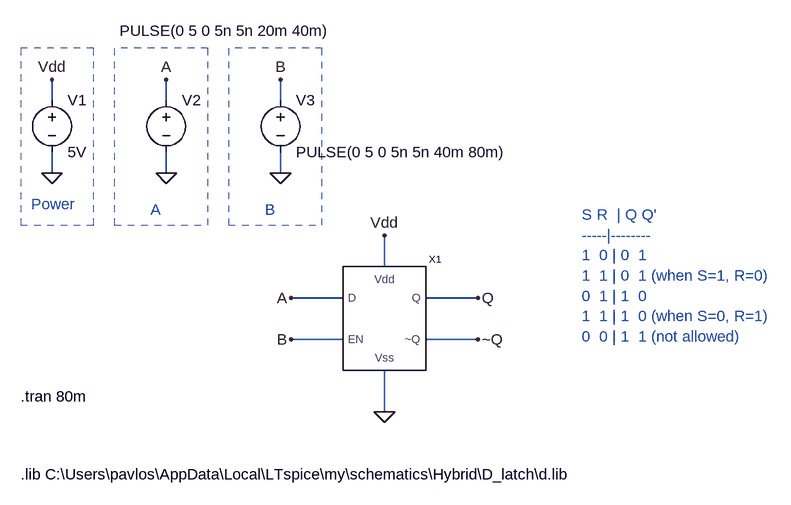
[diagram p0: schematic d_block.asc]
d_block.asc, the LTspice schematic file:
Version 4
SHEET 1 880 680
WIRE -560 -416 -560 -448
WIRE -384 -416 -384 -448
WIRE -208 -416 -208 -448
WIRE -560 -304 -560 -336
WIRE -384 -304 -384 -336
WIRE -208 -304 -208 -336
WIRE -48 -160 -48 -208
WIRE -112 -112 -192 -112
WIRE 96 -112 16 -112
WIRE -112 -48 -192 -48
WIRE 96 -48 16 -48
WIRE -48 64 -48 0
FLAG 96 -112 Q
FLAG -192 -112 A
FLAG -48 -208 Vdd
FLAG -48 64 0
FLAG -560 -304 0
FLAG -560 -448 Vdd
FLAG -384 -304 0
FLAG -384 -448 A
FLAG -192 -48 B
FLAG -208 -304 0
FLAG -208 -448 B
FLAG 96 -48 ~Q
SYMBOL voltage -560 -432 R0
WINDOW 123 0 0 Left 0
WINDOW 39 0 0 Left 0
SYMATTR InstName V1
SYMATTR Value 5V
SYMBOL voltage -384 -432 R0
WINDOW 123 0 0 Left 0
WINDOW 39 0 0 Left 0
WINDOW 3 -72 -91 Left 2
SYMATTR Value PULSE(0 5 0 5n 5n 20m 40m)
SYMATTR InstName V2
SYMBOL voltage -208 -432 R0
WINDOW 123 0 0 Left 0
WINDOW 39 0 0 Left 0
SYMATTR InstName V3
SYMATTR Value PULSE(0 5 0 5n 5n 40m 80m)
SYMBOL d -112 0 R0
SYMATTR InstName X1
TEXT -592 -256 Left 2 ;Power
TEXT -408 -248 Left 2 ;A
TEXT -608 40 Left 2 !.tran 80m
TEXT -608 160 Left 2 !.lib C:\\Users\\pavlos\\AppData\\Local\\LTspice\\my\\schematics\\Hybrid\\D_latch\\d.lib
TEXT -232 -248 Left 2 ;B
TEXT 256 -240 Left 2 ;S R  | Q Q'\n-----|--------\n1  0 | 0  1\n1  1 | 0  1 (when S=1, R=0)\n0  1 | 1  0\n1  1 | 1  0 (when S=0, R=1)\n0  0 | 1  1 (not allowed)
RECTANGLE Normal -496 -496 -608 -224 2
RECTANGLE Normal -320 -496 -464 -224 2
RECTANGLE Normal -144 -496 -288 -224 2

The netlist it stands for:
* d_block.asc
V1 Vdd 0 5V
V2 A 0 PULSE(0 5 0 5n 5n 20m 40m)
V3 B 0 PULSE(0 5 0 5n 5n 40m 80m)
XX1 A B Q ~Q Vdd 0 d  ; pins D EN Q ~Q Vdd Vss
* Power
* A
.tran 80m
.lib C:\Users\pavlos\AppData\Local\LTspice\my\schematics\Hybrid\D_latch\d.lib
* B
* S R  | Q Q'
* -----|--------
* 1  0 | 0  1
* 1  1 | 0  1 (when S=1, R=0)
* 0  1 | 1  0
* 1  1 | 1  0 (when S=0, R=1)
* 0  0 | 1  1 (not allowed)
.backanno
.end

* Results of the author's LTspice run, read from the files saved beside the schematic
* Operating Point, zero values left out:
*   V(vdd) = 5 V
*   V(~q) = 3.018 V
*   V(q) = 3.646 V
*   I(V1) = -488.9 µA
*   I(V3) = 240 µA
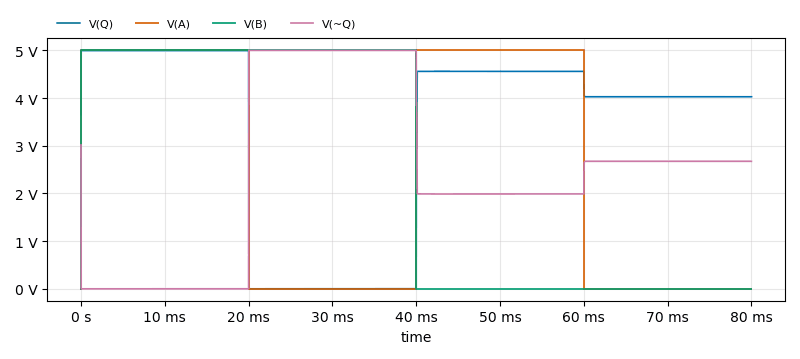
[diagram p1: Transient Analysis of d_block.asc, plotted from the saved traces]
* Transient Analysis, 1 run:
*   V(Q): min 0 V, max 4.997 V, average 3.394 V, rms 3.935 V, last 4.027 V
*   V(A): min 0 V, max 5 V, average 2.5 V, rms 3.536 V, last 0 V
*   V(B): min 0 V, max 5 V, average 2.5 V, rms 3.536 V, last 0 V
*   V(~Q): min 957.3 nV, max 5 V, average 2.417 V, rms 3.006 V, last 2.674 V